# Altium project water_sensor.PrjPcb
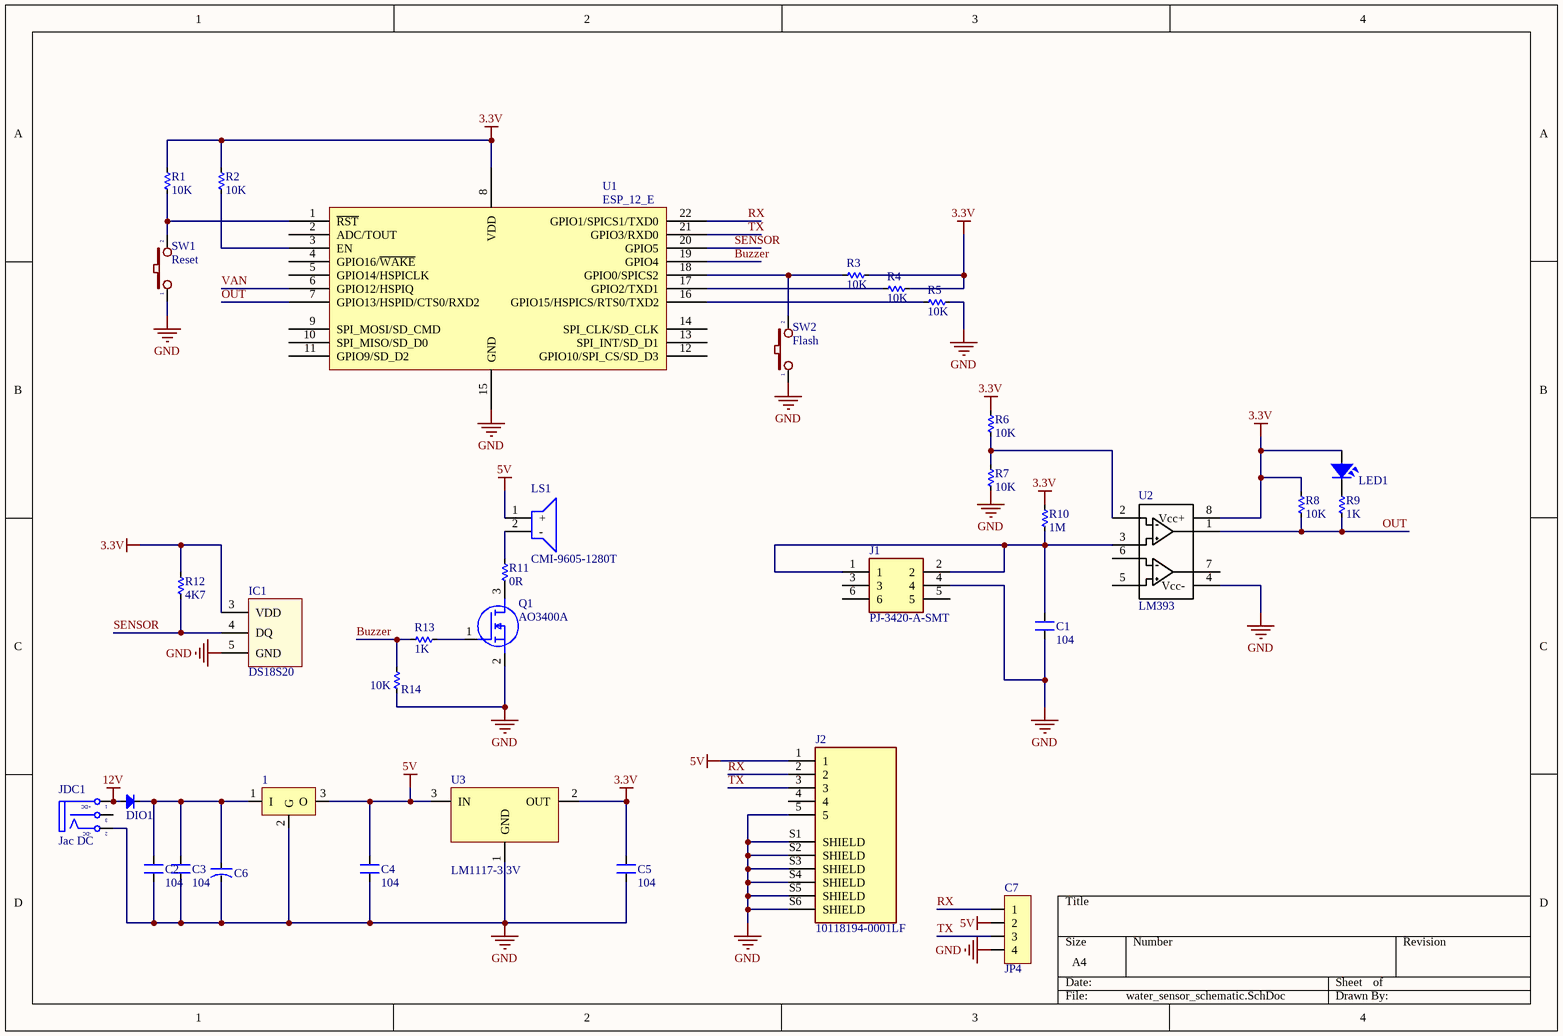
[diagram p0: water_sensor_schematic.SchDoc]
2 sheets, 39 parts. Net scope: global (net labels, ports and power ports of the same name join across sheets).
Board file: water_sensor_pcb.PcbDoc
Sheets:
  water_sensor_schematic.SchDoc
  mosfet.SchDoc

## Sheet water_sensor_schematic.SchDoc
size A4

### Parts
1  LM78xx  [TO252-123]  (value not drawn)
C1  104  [SM-CAP-0805]
C2  104  [SM-CAP-0805]
C3  104  [SM-CAP-0805]
C4  104  [SM-CAP-0805]
C5  104  [SM-CAP-0805]
C6  CN-ALU-SMD  [CAP-ALU-SMD-4.5x5x1.4]  (value not drawn)
C7  JP4  [JP4-C1T]
DIO1  Diode SMD  [DIO-SMD-106]  (value not drawn)
IC1  DS18S20  [DS18S20]
J1  PJ-3420-A-SMT  [PJ3420ASMT]
J2  10118194-0001LF  [AMPHENOL_10118194-0001LF]
JDC1  Jac DC  [DC3]
LED1  LED  [LED-0805-Blue]  (value not drawn)
LS1  CMI-9605-1280T  [CMI96051280T]
Q1  AO3400A  [SOT95P280X125-3N]
R1  10K  [RES-SMD-0805]
R2  10K  [RES-SMD-0805]
R3  10K  [RES-SMD-0805]
R4  10K  [RES-SMD-0805]
R5  10K  [RES-SMD-0805]
R6  10K  [RES-SMD-0805]
R7  10K  [RES-SMD-0805]
R8  10K  [RES-SMD-0805]
R9  1K  [RES-SMD-0805]
R10  1M  [RES-SMD-0805]
R11  0R  [RES-SMD-0805]
R12  4K7  [RES-SMD-0805]
R13  1K  [RES-SMD-0805]
R14  10K  [RES-SMD-0805]
SW1  Reset  [SW1-SMD]
SW2  Flash  [SW-DIP1-1]
U1  ESP_12_E  [ESP_12_E]
U2  LM393  [SO8]
U3  LM1117-3.3V  [SOT223]

### Nets
3.3V: C5.2 IC1.3(VDD) LED1.1 R1.1 R2.1 R3.1 R4.1 R6.1 R8.1 R10.1 R12.1 U1.8(VDD) U2.8(Vcc+) U3.2(OUT)
5V: 1.3(O) C4.2 C7.2 J2.1 LS1.1(+) U3.3(IN)
12V: DIO1.1(A) JDC1.1(T)
GND: 1.2(G) C1.1 C2.1 C3.1 C4.1 C5.1 C6.2 C7.4 IC1.5(GND) J1.4 J2.5 J2.S1(SHIELD) J2.S2(SHIELD) J2.S3(SHIELD) J2.S4(SHIELD) J2.S5(SHIELD) J2.S6(SHIELD) JDC1.2(TN) Q1.2(S) R5.1 R7.2 R14.1 SW1.1 SW2.1 U1.15(GND) U2.4(Vcc-) U3.1(GND)
Buzzer: R13.2 R14.2 U1.19(GPIO4)
OUT: R8.2 R9.2 U1.7(GPIO13/HSPID/CTS0/RXD2) U2.1
RX: C7.1 J2.2 U1.22(GPIO1/SPICS1/TXD0)
SENSOR: IC1.4(DQ) R12.2 U1.20(GPIO5)
TX: C7.3 J2.3 U1.21(GPIO3/RXD0)
VAN: U1.6(GPIO12/HSPIQ)
Net1_1: 1.1(I) C2.2 C3.2 C6.1 DIO1.2(K)
NetC1_2: C1.2 J1.1 J1.2 R10.2 U2.3
NetLED1_2: LED1.2 R9.1
NetLS1_2: LS1.2(-) R11.1
NetQ1_1: Q1.1(G) R13.1
NetQ1_3: Q1.3(D) R11.2
NetR1_2: R1.2 SW1.2 U1.1(~{RST})
NetR2_2: R2.2 U1.3(EN)
NetR3_2: R3.2 SW2.2 U1.18(GPIO0/SPICS2)
NetR4_2: R4.2 U1.17(GPIO2/TXD1)
NetR5_2: R5.2 U1.16(GPIO15/HSPICS/RTS0/TXD2)
NetR6_2: R6.2 R7.1 U2.2

Not connected (* = marked no-connect by the designer): J1 3 5 6; J2 4; JDC1 3(S); U1 2(ADC/TOUT) 4(GPIO16/~{WAKE}) 5(GPIO14/HSPICLK) 9(SPI_MOSI/SD_CMD) 10(SPI_MISO/SD_D0) 11(GPIO9/SD_D2) 12(GPIO10/SPI_CS/SD_D3) 13(SPI_INT/SD_D1) 14(SPI_CLK/SD_CLK); U2 5 6 7

### Notes on the sheet
- (in symbol DCIN) +DC; -DC

### Library data of the parts
1 = LM78xx: Positive Voltage Regulator; Note: Tab is connected to pin 3 (GND).; Published: 24-Aug-2001; LatestRevisionDate: 17-Jul-2002; LatestRevisionNote: Re-released for DXP Platform.; DatasheetVersion: Apr-1994; PackageVersion: Jul-1998; PackageReference: ISOWATT220AB; Publisher: Altium Limited; PackageDescription: TO, Thru-Hole, Vertical, Heatsink Mounted; 3 In-Line Leads; Pitch 2.54 mm; Pin sequence 1, 3, 2; ComponentLink1Description: Manufacturer Link; ComponentLink1URL: http://www.st.com/; ComponentLink2Description: Datasheet; ComponentLink2URL: http://www.st.com/stonline/products/literature/ds/2146/l78m05c.pdf
C1-C5 = CN: Value: 0,1uF/300V; Designed by: VanDungEvn
C6 = CN-ALU-SMD: Polarized Capacitor (Axial); Published: 8-Jun-2000; LatestRevisionDate: 17-Jul-2002; LatestRevisionNote: Re-released for DXP Platform.; PackageReference: POLAR0.8; Publisher: Altium Limited
C7 = JP4: WR-PHD 2.54 mm Angled Socket Header; Manufacturer: W¨¹rth Elektronik eiSos GmbH; partNo: 613004143121; ComponentLink1 Description: Manufacturer; ComponentLink2 Description: Datasheet; NoPins: 04; Created Date: 29 March 2013; ComponentLink1URL: http://www.we-online.com; ComponentLink2URL: http://katalog.we-online.de/em/datasheet/6130xx143121.pdf; Created by: Karrer Zheng
DIO1 = Diode SMD: Default Diode; Code - JEDEC: DO-214-AB; Value: 1N5007; Published: 8-Jun-2000; Revision: July-2002: Re-released for DXP Platform.; Publisher: Altium Limited
IC1 = DS18S20: High Precision  1-Wire® Digital Thermometer
J1 = PJ-3420-A-SMT: Connector; Manufacturer_Name: XKB Connectivity; Datasheet Link: http://www.helloxkb.com/public/images/pdf/PJ-3420-X-SMT.pdf; Height: 4.5mm; Manufacturer_Part_Number: PJ-3420-A-SMT
J2 = 10118194-0001LF: USB - micro B USB 2.0 Receptacle Connector 5 Position Surface Mount, Right Angle; Through Hole; MF: Amphenol ICC; Package: None; Price: None; Availability: Unavailable; MP: 10118194-0001LF; SnapEDA_Link: https://www.snapeda.com/parts/10118194-0001LF/Amphenol%20FCI/view-part/1413308/?ref=snap; Value: *
JDC1 = DCIN: Jac DC input; Value: Jac DC
LED1 = LED SMD: Value: LED 3 - 5 ly 2 Colour
LS1 = CMI-9605-1280T: Loudspeaker or Buzzer; Manufacturer_Name: CUI Devices; Datasheet Link: https://www.mouser.com/datasheet/2/670/cmi-9605-1280t-1627757.pdf; Height: 5.5mm; Manufacturer_Part_Number: CMI-9605-1280T; Mouser Part Number: 490-CMI-9605-1280T; Mouser Price/Stock: https://www.mouser.co.uk/ProductDetail/CUI-Devices/CMI-9605-1280T?qs=P1JMDcb91o4jVbreCBkoMQ%3D%3D; Arrow Part Number: CMI-9605-1280T; Arrow Price/Stock: https://www.arrow.com/en/products/cmi-9605-1280t/cui-devices?region=nac
Q1 = AO3400A: MOSFET (N-Channel); Manufacturer_Name: Alpha & Omega Semiconductors; Datasheet Link: http://aosmd.com/res/data_sheets/AO3400A.pdf; Height: 1.25mm; Manufacturer_Part_Number: AO3400A; Arrow Part Number: AO3400A; Arrow Price/Stock: https://www.arrow.com/en/products/ao3400a/alpha-and-omega-semiconductor?region=nac
R1-R14 = Res-SMD: Resistor; Manufacturer: Generic Components; Class: Passive; Published: 08/06/2000; Publisher: Altium Hobart Technology Centre
SW1 SW2 = SW2: Switch button 2 pin; Value: SW chip 2 pin
U1 = ESP_12_E: ESP-12 Wi-Fi Module by AI-Thinker; IC: ESP8266-EX; Vendor: Ai-thinker
U2 = LM393: IC DUAL COMPARATOR
U3 = LM1117: 800mA Low-Dropout Linear Regulator; Creator: Nguyen Ba Bien; Website: http://group3i.net

## Sheet mosfet.SchDoc
size A
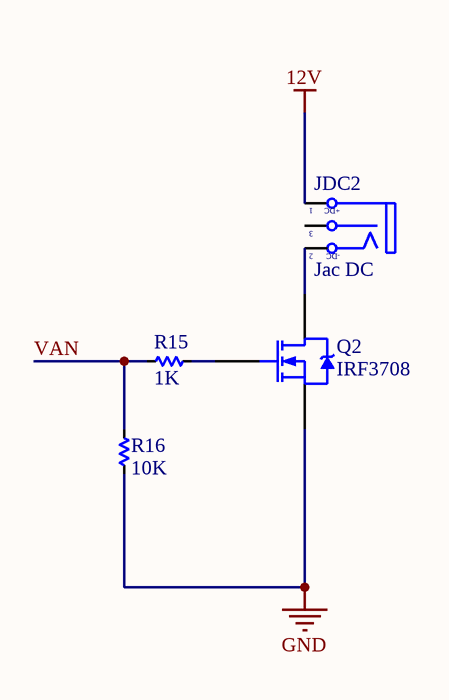
[diagram p1: mosfet.SchDoc]

### Parts
JDC2  Jac DC  [DC3]
Q2  IRF3708  [TO-252AA_N]
R15  1K  [RES-SMD-0805]
R16  10K  [RES-SMD-0805]

### Nets
12V: JDC2.1(T)
GND: Q2.3(S) R16.2
VAN: R15.1 R16.1
NetJDC2_2: JDC2.2(TN) Q2.4(D)
NetQ2_1: Q2.1(G) R15.2

Not connected (* = marked no-connect by the designer): JDC2 3(S)

### Notes on the sheet
- (in symbol DCIN) +DC; -DC

### Library data of the parts
JDC2 = DCIN: Jac DC input; Value: Jac DC
Q2 = IRFR3911: HEXFET Power MOSFET; Note: Pin 2 is trimmed and not drawn; Published: 17-Sep-2003; LatestRevisionDate: 20-Nov-2009; LatestRevisionNote: IPC-7351 Footprint Added.; DatasheetVersion: 22-Jan-2002; PackageVersion: Feb-2003; PackageReference: TO-252AA; Publisher: Altium Limited; PackageDescription: 3-Pin HEXFET Package 2.28 mm Pitch, 9.9 mm Lead Span; Code_JEDEC: TO-252-AA; ComponentLink1Description: Manufacturer Link; ComponentLink1URL: http://www.irf.com/; ComponentLink2Description: Datasheet; ComponentLink2URL: http://www.irf.com/product-info/datasheets/data/irfr3911.pdf
R15 R16 = Res-SMD: as R1 on sheet water_sensor_schematic; Published: 08/06/2000; Publisher: Altium Hobart Technology Centre

## Nets that join several sheets
12V: water_sensor_schematic (DIO1.1 JDC1.1), mosfet (JDC2.1)
GND: water_sensor_schematic (27 pins), mosfet (Q2.3 R16.2)
VAN: water_sensor_schematic (U1.6), mosfet (R15.1 R16.1)